# Altium schematic sheet conn_isouart.SchDoc
size A
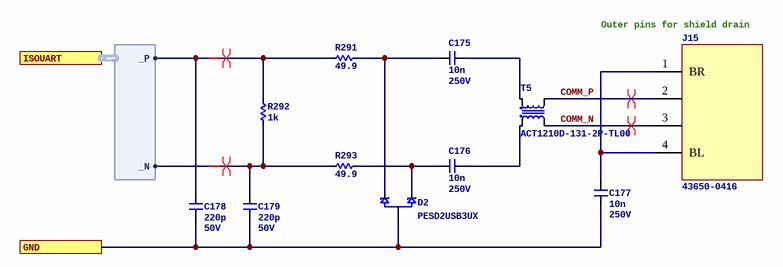
[diagram p0: conn_isouart.SchDoc]

## Parts
C175  Capacitance: 10n  Voltage Rating: 250V  [C0805]  (hidden comment: GRM21B5C2E103JWAAL)
C176  Capacitance: 10n  Voltage Rating: 250V  [C0805]  (hidden comment: GRM21B5C2E103JWAAL)
C177  Capacitance: 10n  Voltage Rating: 250V  [C0805]  (hidden comment: GRM21B5C2E103JWAAL)
C178  Capacitance: 220p  Voltage Rating: 50V  [C0402]  (hidden comment: GRM1555C1H221JA01D)
C179  Capacitance: 220p  Voltage Rating: 50V  [C0402]  (hidden comment: GRM1555C1H221JA01D)
D2  PESD2USB3UX  [3SOT23]
J15  43650-0416  [MOLEX_MICROFIT_0436500416]
R291  value 49.9  [R0402]  (hidden comment: 0402WGF499JTCE)
R292  value 1k  [R0402]  (hidden comment: 0402WGF1001TCE)
R293  value 49.9  [R0402]  (hidden comment: 0402WGF499JTCE)
T5  ACT1210D-131-2P-TL00  [CHOKE_ACT1210D-131-2P-TL00]

## Ports
GND, ISOUART (harness DIFF)

## Harnesses
DIFF: _P, _N

## Nets
COMM_N: J15.3 T5.4
COMM_P: J15.2 T5.3
GND: C177.2 C178.2 C179.2 D2.3 ; port GND
NetC175_1: C175.1 D2.2 R291.2
NetC175_2: C175.2 T5.2
NetC176_1: C176.1 D2.1 R293.2
NetC176_2: C176.2 T5.1
NetC177_1: C177.1 J15.1(BR) J15.4(BL)
NetC178_1: C178.1 R291.1 R292.2 ; port ISOUART._P
NetC179_1: C179.1 R292.1 R293.1 ; port ISOUART._N

## Layout directives
differential pair; differential pair class DE_100: COMM_N, COMM_P, NetC178_1, NetC179_1

## Notes on the sheet
- (near J15) Outer pins for shield drain

## Library data of the parts
C175-C177 = GRM21B5C2E103JWAAL: Manufacturer: Murata Electronics; Dielectric: C0G; Manufacturer Part Number: GRM21B5C2E103JWAAL; ComponentLink1URL: https://wmsc.lcsc.com/wmsc/upload/file/pdf/v2/lcsc/2308111754_Murata-Electronics-GRM21B5C2E103JWAAL_C3870620.pdf; ComponentLink1Description: Datasheet; Package: 0805; Supplier 2: LCSC; Supplier Part Number 2: C3870620
C178 C179 = GRM1555C1H221JA01D: Manufacturer: Murata Electronics; Dielectric: C0G; Manufacturer Part Number: GRM1555C1H221JA01D; ComponentLink1URL: https://wmsc.lcsc.com/wmsc/upload/file/pdf/v2/lcsc/1811081614_Murata-Electronics-GRM1555C1H221JA01D_C71693.pdf; ComponentLink1Description: Datasheet; Package: 0402; Supplier 2: LCSC; Supplier Part Number 2: C71693
D2 = TVS_PESD2USB3UX-T: DIODE ESD USB SOT-23; Manufacturer: Nexperia USA Inc.; Supplier 1: Digikey; Supplier Part Number 1: 1727-PESD2USB3UX-CT-ND; Manufacturer Part Number: PESD2USB3UX; Supplier 2: LCSC; Supplier Part Number 2: C3708426; ComponentLink1Description: Datasheet; ComponentLink1URL: https://assets.nexperia.com/documents/data-sheet/PESD2USB3UX-T.pdf
J15 = CONN_MOLEX_MICROFIT_4POS_VERT_43650-0416: Connector Header Through Hole 4 position 0.118" (3.00mm); Manufacturer: Molex; Manufacturer Part Number: 43650-0416; ComponentLink1Description: Drawing; ComponentLink1URL: https://www.molex.com/content/dam/molex/molex-dot-com/products/automated/en-us/salesdrawingpdf/436/43650/436500416_sd.pdf?inline; ComponentLink2Description: Product page; ComponentLink2URL: https://www.molex.com/en-us/products/part-detail/436500416; Supplier 1: Digikey; Supplier Part Number 1: WM1924-ND; Supplier Part Number 2: C587671; Supplier 2: LCSC
R291 R293 = 0402WGF499JTCE: Manufacturer: UNI-ROYAL(Uniroyal Elec); Tolerance: 1%; Temperature Coefficient: Â±100ppm/â„ƒ; Power Rating (mW): 62.5; Manufacturer Part Number: 0402WGF499JTCE; ComponentLink1Description: Datasheet; ComponentLink1URL: https://wmsc.lcsc.com/wmsc/upload/file/pdf/v2/lcsc/2205311900_UNI-ROYAL-Uniroyal-Elec-0402WGF499JTCE_C25120.pdf; Package: 0402; Supplier 2: LCSC; Supplier Part Number 2: C25120
R292 = 0402WGF1001TCE: Manufacturer: UNI-ROYAL(Uniroyal Elec); Tolerance: 1%; Temperature Coefficient: Â±100ppm/â„ƒ; Power Rating (mW): 62.5; Manufacturer Part Number: 0402WGF1001TCE; ComponentLink1Description: Datasheet; ComponentLink1URL: https://wmsc.lcsc.com/wmsc/upload/file/pdf/v2/lcsc/2206010216_UNI-ROYAL-Uniroyal-Elec-0402WGF1001TCE_C11702.pdf; Package: 0402; Supplier 2: LCSC; Supplier Part Number 2: C11702
T5 = CHOKE_ACT1210D-131-2P-TL00: 130 µH @ 100 kHz 2 Line Common Mode Choke Surface Mount 6.7 kOhms @ 10 MHz 115mA DCR 3.5Ohm; Manufacturer: TDK Corporation; Supplier 1: Digikey; ComponentLink1URL: https://product.tdk.com/system/files/dam/doc/product/emc/emc/cmf_cmc/catalog/cmf_automotive_signal_act1210d_en.pdf; ComponentLink1Description: Datasheet; Supplier Part Number 1: 445-ACT1210D-131-2P-TL00CT-ND; Manufacturer Part Number: ACT1210D-131-2P-TL00; Supplier 2: LCSC; Supplier Part Number 2: C5547342